# EAGLE design MotorBoardDev (EAGLE 8.6.0)
IGVC Motor Control Board
REVISION: v1.1; SCH_DESC: Motor Control Board; TEAM: IGVC

## Sheet 1 of 4: mBed Breakout
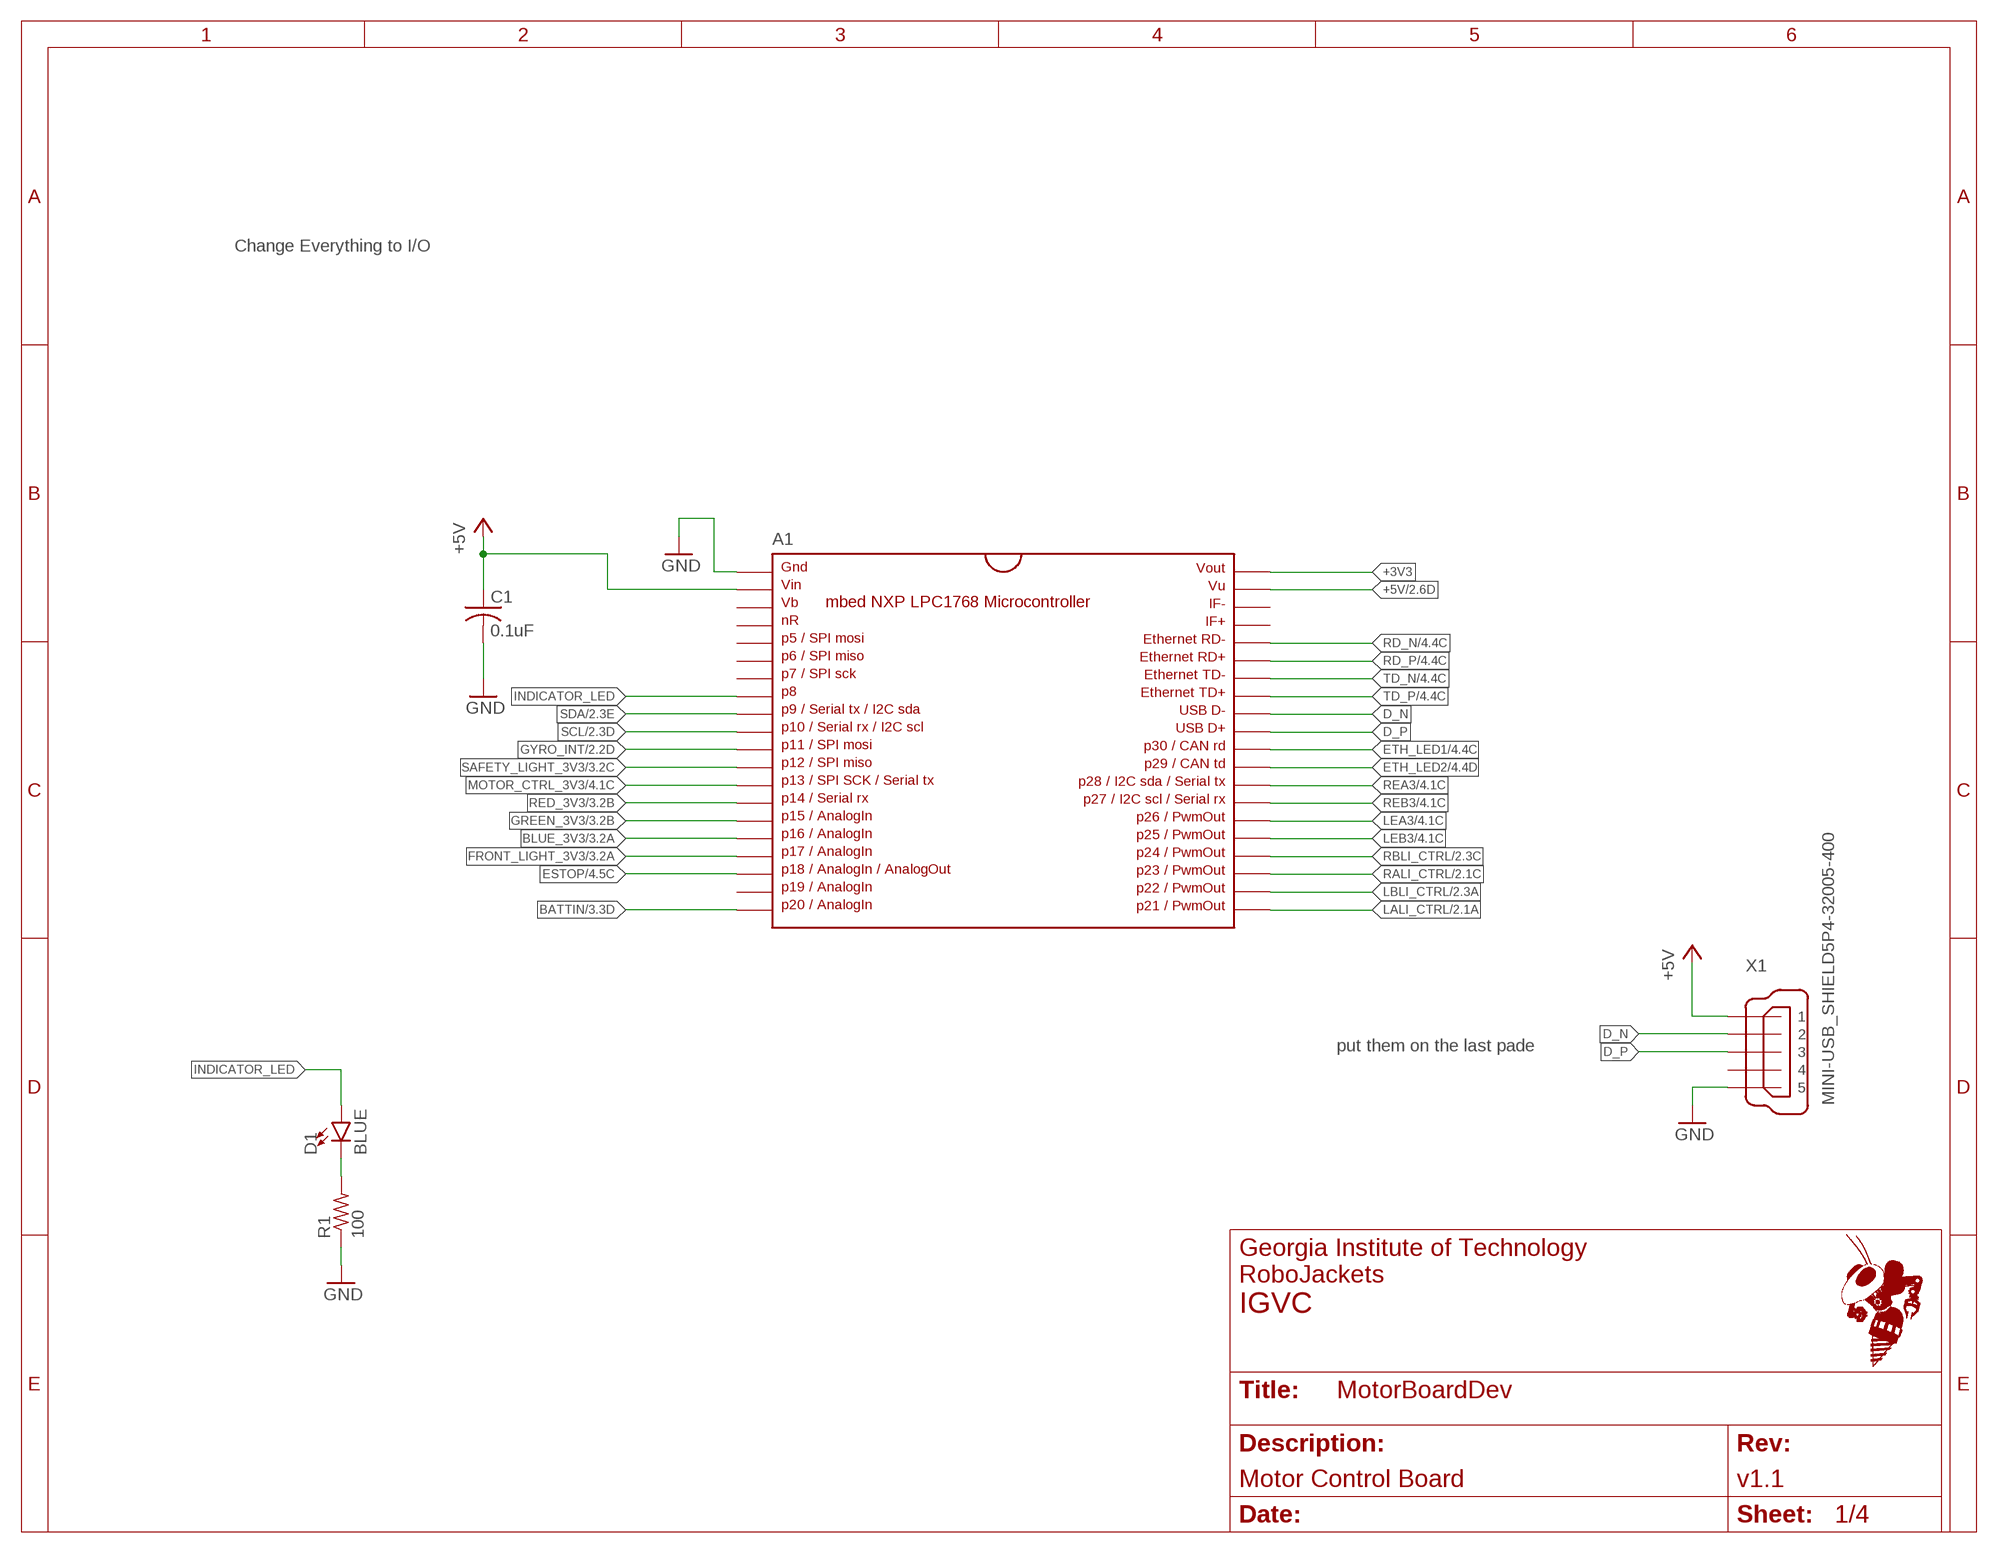
[diagram p0: schematic, sheet 1]

### Parts
A1  MBED1768  SPARKFUN-BOARDS_MBED_NXP_LPC1768  [SPARKFUN-BOARDS_DIL40_0.9]
C1  0.1uF  C-USC0603  [C0603]
D1  BLUE  LED-BLUE0603  [LED-0603]
R1  100  R-US_R0603  [R0603]
X1  MINI-USB_SHIELD5P4-32005-400  [32005-400]

### Nets
+3V3: A1.40 ; also sheet 2,3,4
+5V: A1.2 A1.39 C1.1 X1.1 ; also sheet 2,3,4
BATTIN: A1.20 ; also sheet 3
BLUE_3V3: A1.16 ; also sheet 3
D_N: A1.32 X1.2
D_P: A1.31 X1.3
ESTOP: A1.18 ; also sheet 4
ETH_LED1: A1.30 ; also sheet 4
ETH_LED2: A1.29 ; also sheet 4
FRONT_LIGHT_3V3: A1.17 ; also sheet 3
GND: A1.1 C1.2 R1.1 X1.5 ; also sheet 2,3,4
GREEN_3V3: A1.15 ; also sheet 3
GYRO_INT: A1.11 ; also sheet 2
INDI_LED_R: D1.C R1.2
INDICATOR_LED: A1.8 D1.A
LALI_CTRL: A1.21 ; also sheet 2
LBLI_CTRL: A1.22 ; also sheet 2
LEA3: A1.26 ; also sheet 4
LEB3: A1.25 ; also sheet 4
MOTOR_CTRL_3V3: A1.13 ; also sheet 4
RALI_CTRL: A1.23 ; also sheet 2
RBLI_CTRL: A1.24 ; also sheet 2
RD_N: A1.36 ; also sheet 4
RD_P: A1.35 ; also sheet 4
REA3: A1.28 ; also sheet 4
REB3: A1.27 ; also sheet 4
RED_3V3: A1.14 ; also sheet 3
SAFETY_LIGHT_3V3: A1.12 ; also sheet 3
SCL: A1.10 ; also sheet 2
SDA: A1.9 ; also sheet 2
TD_N: A1.34 ; also sheet 4
TD_P: A1.33 ; also sheet 4
Unconnected: A1.3 A1.4 A1.5 A1.6 A1.7 A1.19 A1.37 A1.38 X1.4 X1.M1(S1) X1.M2(S2) X1.M3(S3) X1.M4(S4)

### Notes on the sheet
- Change Everything to I/O
- put them on the last pade

## Sheet 2 of 4: Motor Control
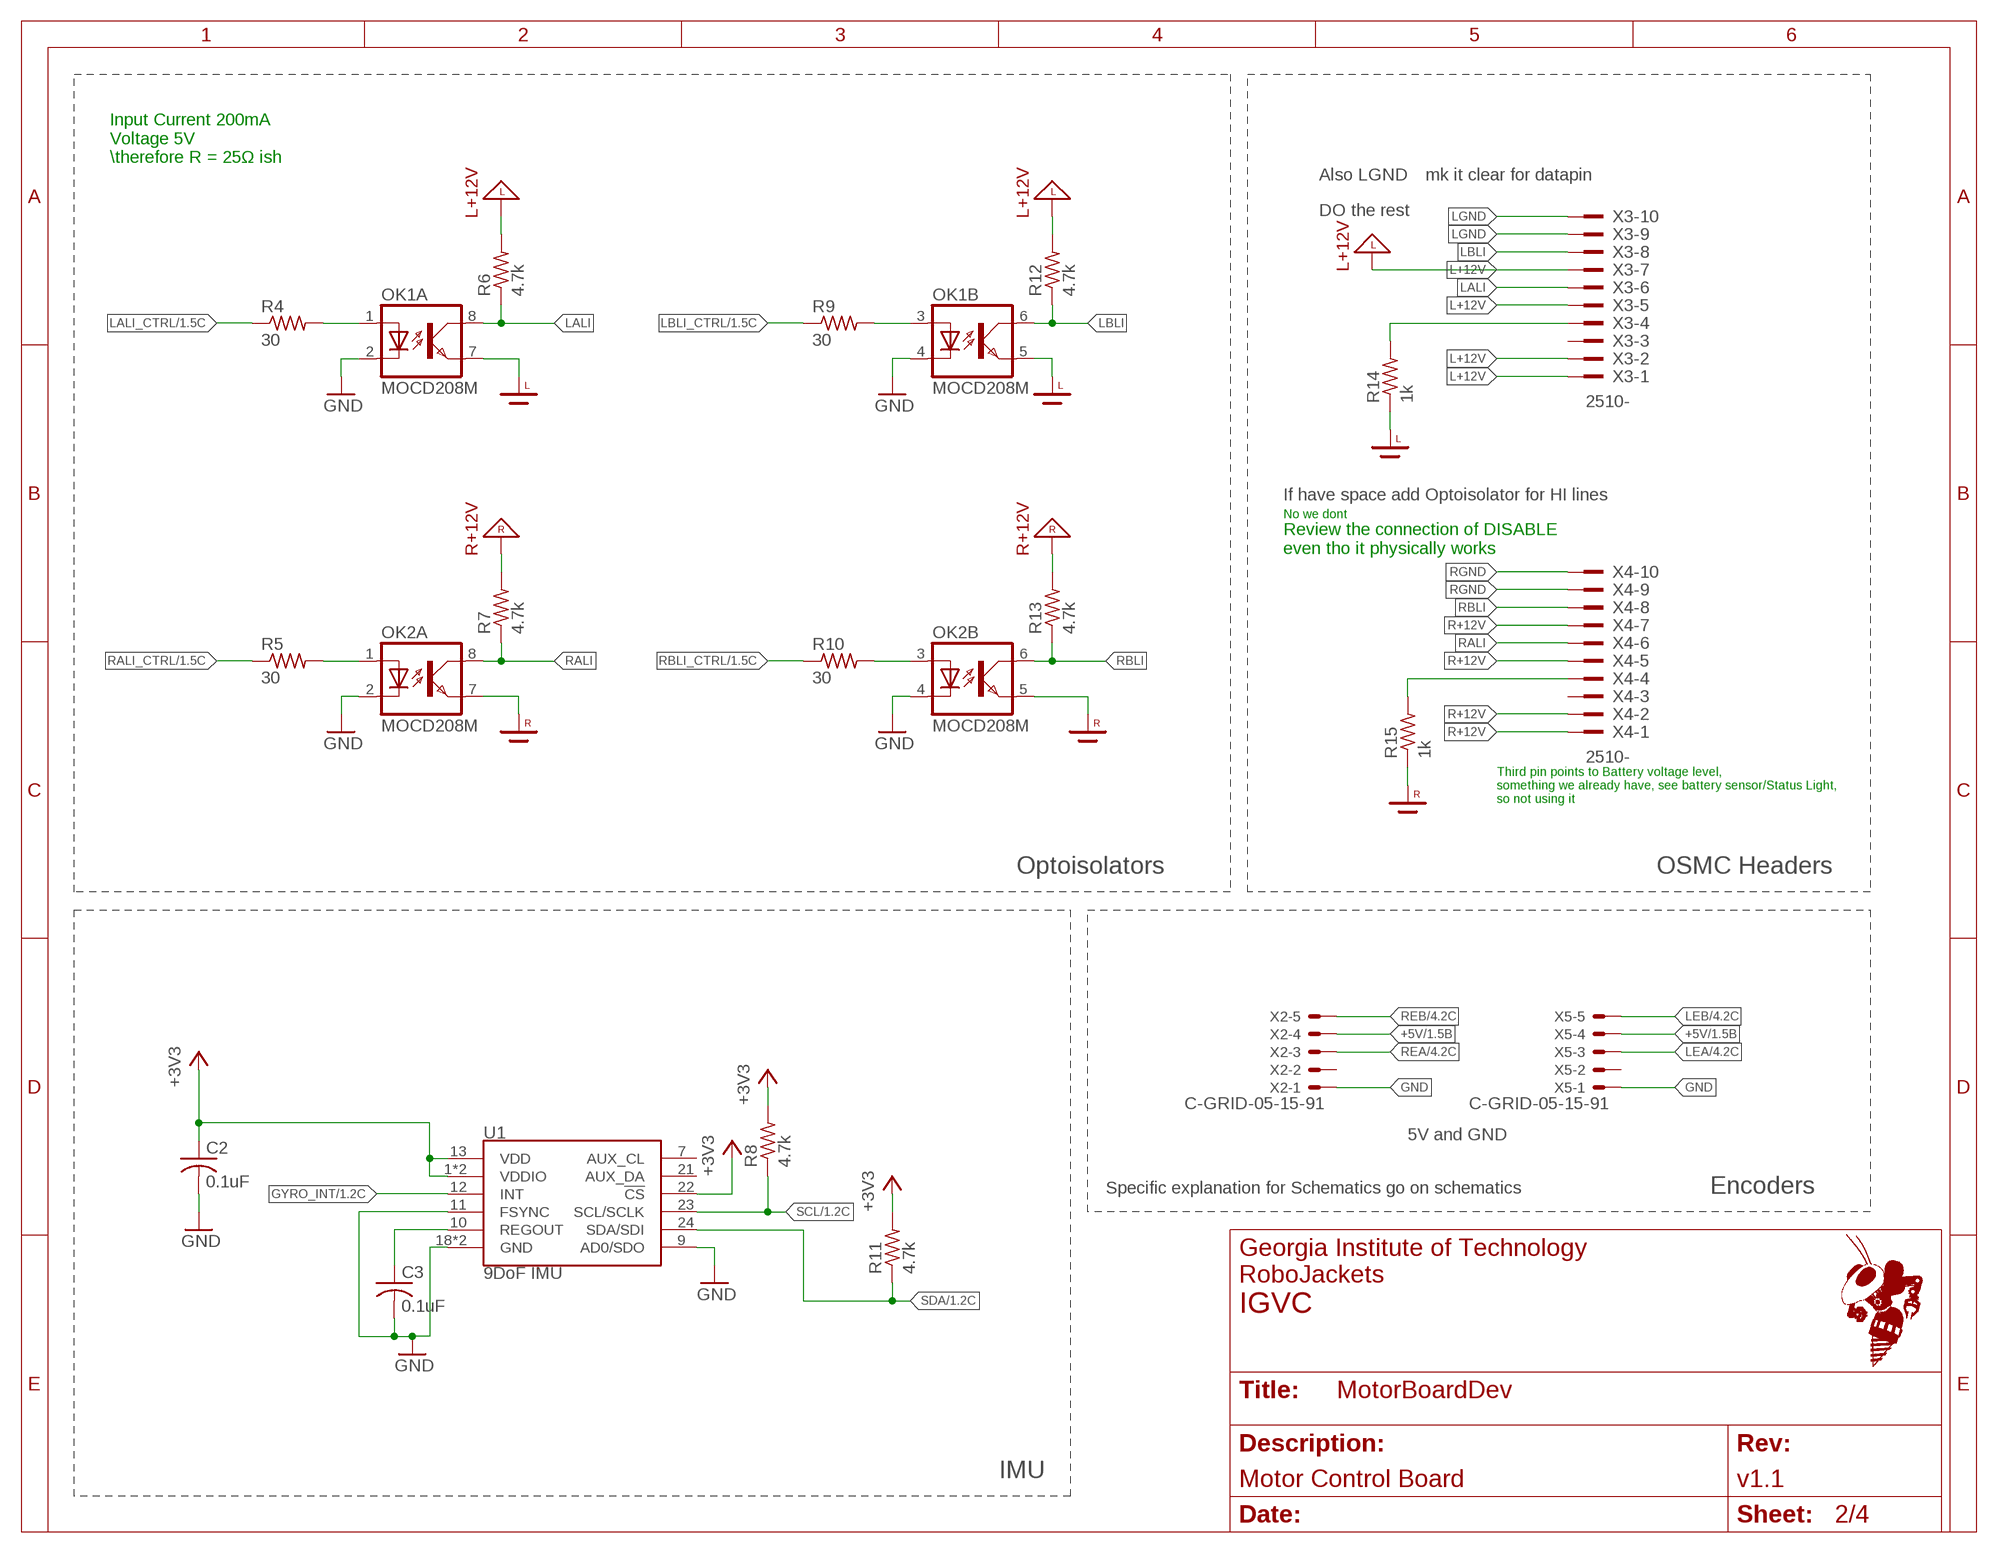
[diagram p1: schematic, sheet 2]

### Parts
C2  0.1uF  C-USC0603  [C0603]
C3  0.1uF  C-USC0603  [C0603]
OK1  MOCD208M  [SOIC08-FAIRCHILD]
OK2  MOCD208M  [SOIC08-FAIRCHILD]
R4  30  R-US_R0603  [R0603]
R5  30  R-US_R0603  [R0603]
R6  4.7k  R-US_R0603  [R0603]
R7  4.7k  R-US_R0603  [R0603]
R8  4.7k  R-US_R0603  [R0603]
R9  30  R-US_R0603  [R0603]
R10  30  R-US_R0603  [R0603]
R11  4.7k  R-US_R0603  [R0603]
R12  4.7k  R-US_R0603  [R0603]
R13  4.7k  R-US_R0603  [R0603]
R14  1k  R-US_R0603  [R0603]
R15  1k  R-US_R0603  [R0603]
U1  9DoF IMU  MPU-9250  [QFN24-3X3]
X2  C-GRID-05-15-91  [15-91-05]
X3  2510-  [PAK100/2500-10]
X4  2510-  [PAK100/2500-10]
X5  C-GRID-05-15-91  [15-91-05]

### Nets
+3V3: C2.1 R8.2 R11.2 U1.1(VDDIO) U1.8(VDDIO) U1.13(VDD) U1.22(!CS) ; also sheet 1,3,4
+5V: X2.4 X5.4 ; also sheet 1,3,4
GND: C2.2 C3.2 OK1.2(A:C) OK1.4(B:C) OK2.2(A:C) OK2.4(B:C) U1.9(AD0/SDO) U1.11(FSYNC) U1.18(GND) U1.20(GND) X2.1 X5.1 ; also sheet 1,3,4
GYRO_INT: U1.12(INT) ; also sheet 1
L+12V: R6.2 R12.2 X3.1 X3.2 X3.5 X3.7
LALI: OK1.8(A:COL) R6.1 X3.6
LALI_CTRL: R4.1 ; also sheet 1
LBLI: OK1.6(B:COL) R12.1 X3.8
LBLI_CTRL: R9.1 ; also sheet 1
LDISABLE: R14.2 X3.4
LEA: X5.3 ; also sheet 4
LEB: X5.5 ; also sheet 4
LGND: OK1.5(B:EMIT) OK1.7(A:EMIT) R14.1 X3.9 X3.10
R+12V: R7.2 R13.2 X4.1 X4.2 X4.5 X4.7
R_OK3A: OK1.1(A:A) R4.2
R_OK3B: OK1.3(B:A) R9.2
R_OK4A: OK2.1(A:A) R5.2
R_OK4B: OK2.3(B:A) R10.2
RALI: OK2.8(A:COL) R7.1 X4.6
RALI_CTRL: R5.1 ; also sheet 1
RBLI: OK2.6(B:COL) R13.1 X4.8
RBLI_CTRL: R10.1 ; also sheet 1
RDISABLE: R15.2 X4.4
REA: X2.3 ; also sheet 4
REB: X2.5 ; also sheet 4
REGOUT_C: C3.1 U1.10(REGOUT)
RGND: OK2.5(B:EMIT) OK2.7(A:EMIT) R15.1 X4.9 X4.10
SCL: R8.1 U1.23(SCL/SCLK) ; also sheet 1
SDA: R11.1 U1.24(SDA/SDI) ; also sheet 1
Unconnected: U1.7(AUX_CL) U1.21(AUX_DA) X2.2 X3.3 X4.3 X5.2

### Notes on the sheet
- Input Current 200mA
  Voltage 5V
  \therefore R = 25Ω ish
- Also LGND | mk it clear for datapin
- DO the rest
- If have space add Optoisolator for HI lines
- No we dont
- Review the connection of DISABLE
  even tho it physically works
- Third pin points to Battery voltage level,
  something we already have, see battery sensor/Status Light,
  so not using it
- Optoisolators | OSMC Headers
- 5V and GND
- Specific explanation for Schematics go on schematics | Encoders
- IMU

## Sheet 3 of 4: Light Control
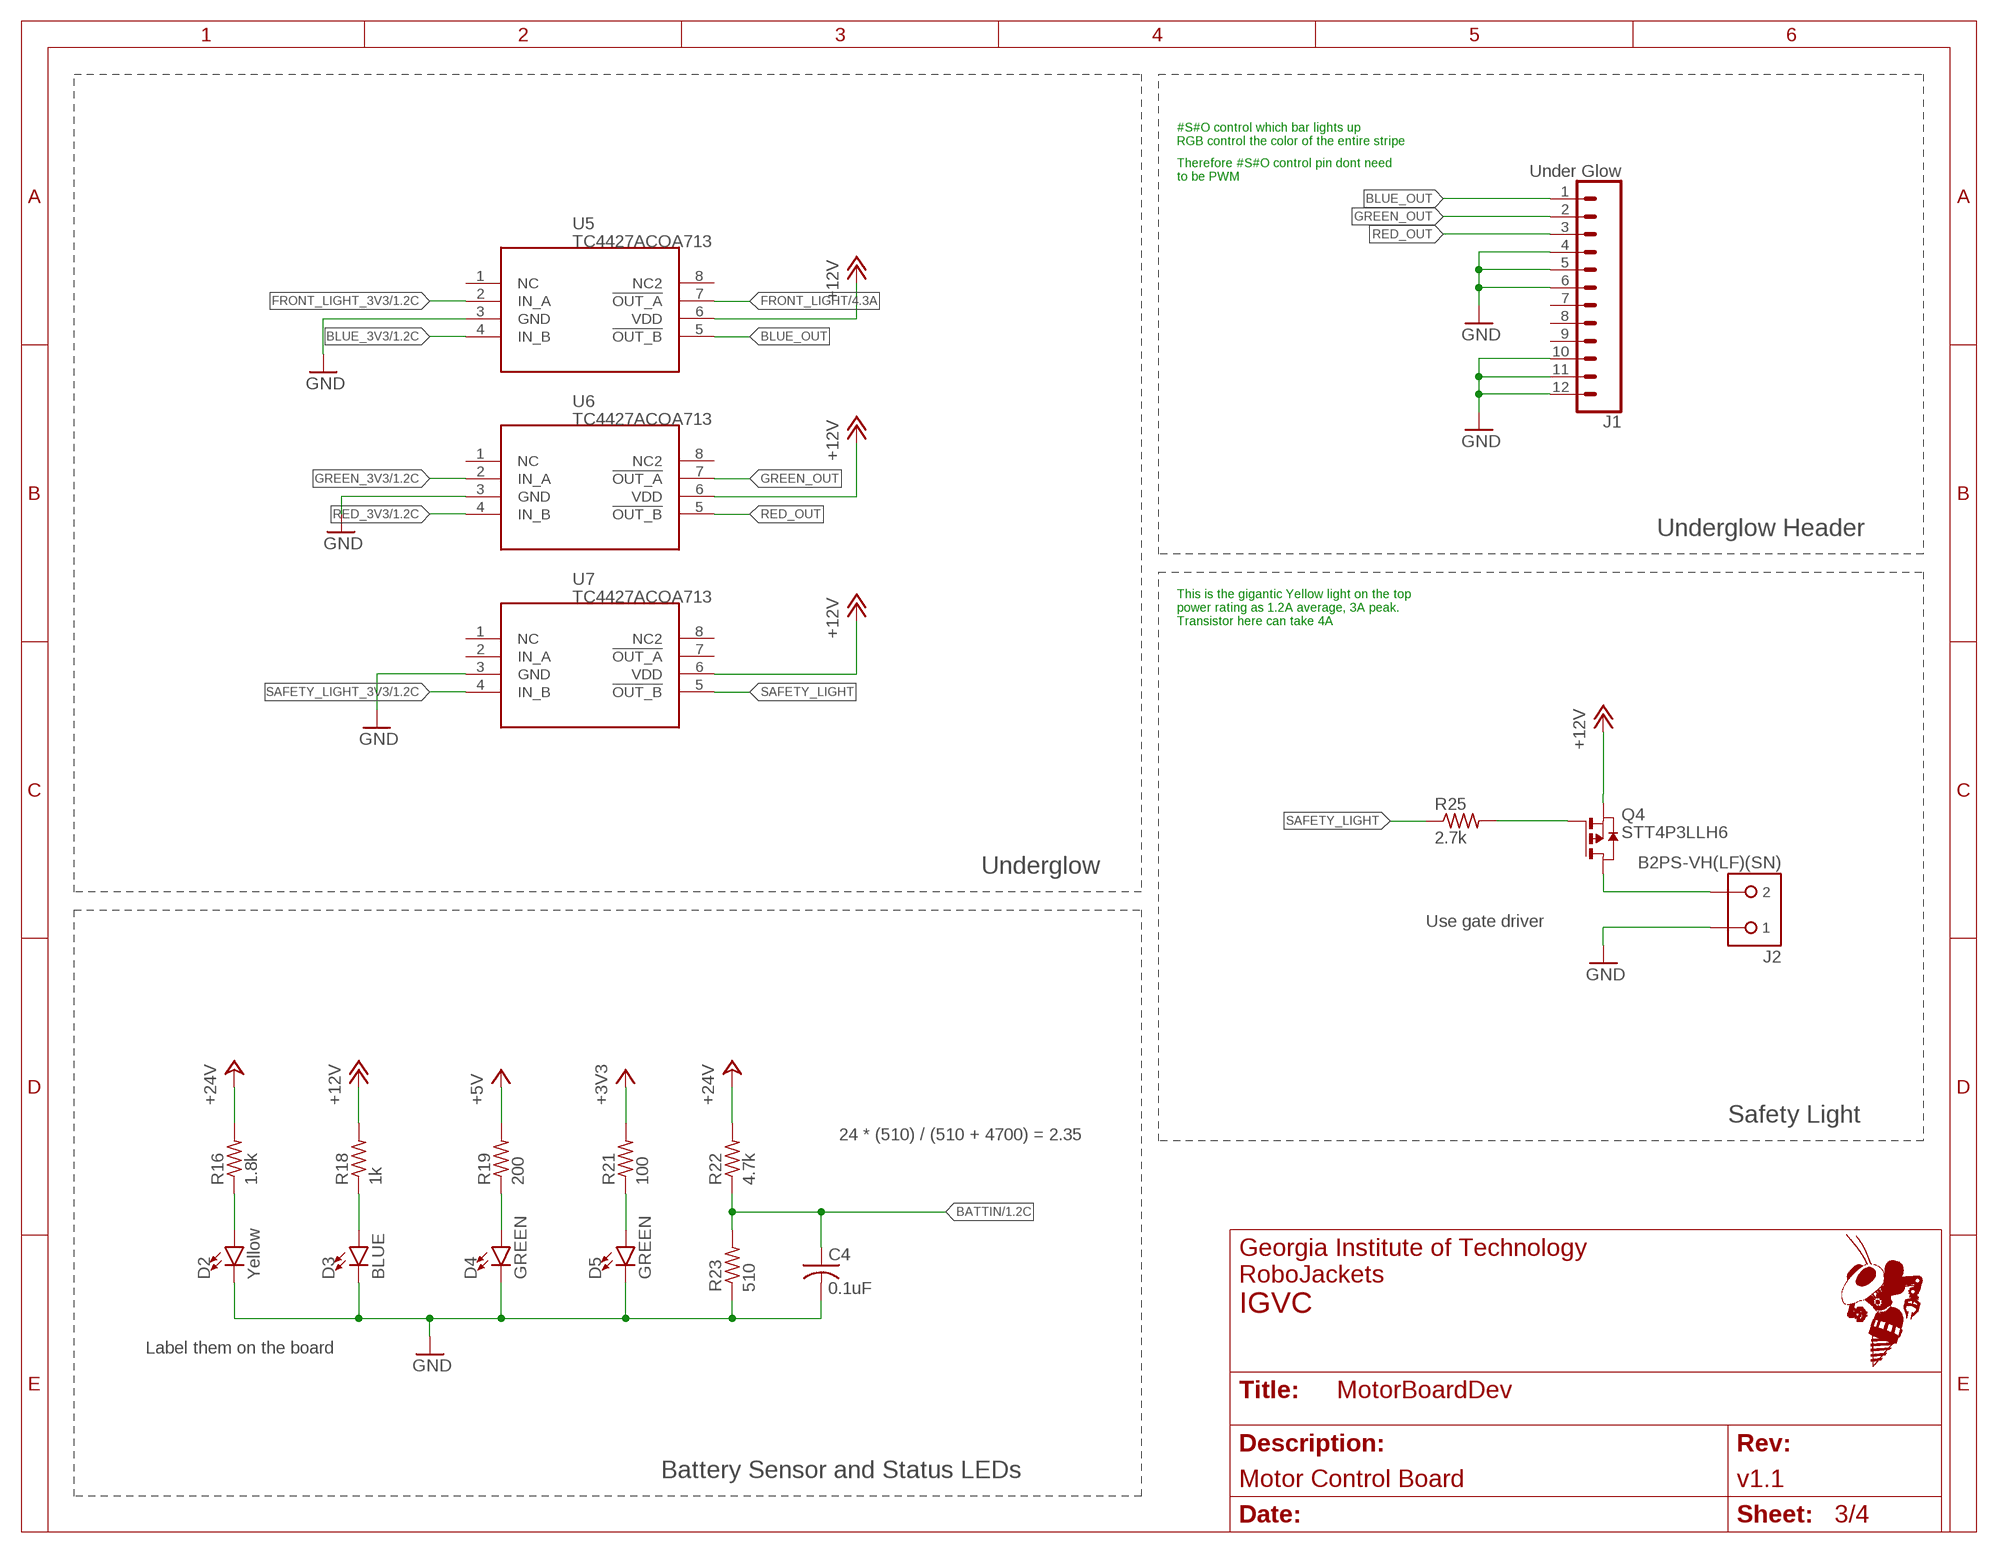
[diagram p2: schematic, sheet 3]

### Parts
C4  0.1uF  C-USC0603  [C0603]
D2  Yellow  LED-YELLOW0603  [LED-0603]
D3  BLUE  LED-BLUE0603  [LED-0603]
D4  GREEN  LED-GREEN0603  [LED-0603]
D5  GREEN  LED-GREEN0603  [LED-0603]
J1  Under Glow  CONN_12LOCK_LONGPADS  [1X12_LOCK_LONGPADS]
J2  B2PS-VH(LF)(SN)  [B2PS-CENTERED]
Q4  STT4P3LLH6  [SOT23-6]
R16  1.8k  R-US_R0603  [R0603]
R18  1k  R-US_R0603  [R0603]
R19  200  R-US_R0603  [R0603]
R21  100  R-US_R0603  [R0603]
R22  4.7k  R-US_R0603  [R0603]
R23  510  R-US_R0603  [R0603]
R25  2.7k  R-US_R0603  [R0603]
U5  TC4427ACOA713  [SOIC-8]
U6  TC4427ACOA713  [SOIC-8]
U7  TC4427ACOA713  [SOIC-8]

### Nets
3V3_LED_R: D5.A R21.1
5V_LED_R: D4.A R19.1
12V_LED_R: D3.A R18.1
24V_LED_R: D2.A R16.1
+3V3: R21.2 ; also sheet 1,2,4
+5V: R19.2 ; also sheet 1,2,4
+12V: Q4.4(S) R18.2 U5.6(VDD) U6.6(VDD) U7.6(VDD) ; also sheet 4
+24V: R16.2 R22.2 ; also sheet 4
BATTIN: C4.1 R22.1 R23.2 ; also sheet 1
BLUE_3V3: U5.4(IN_B) ; also sheet 1
BLUE_OUT: J1.1 U5.5(!OUT_B)
FRONT_LIGHT: U5.7(!OUT_A) ; also sheet 4
FRONT_LIGHT_3V3: U5.2(IN_A) ; also sheet 1
GND: C4.2 D2.C D3.C D4.C D5.C J1.4 J1.5 J1.6 J1.10 J1.11 J1.12 J2.1 R23.1 U5.3(GND) U6.3(GND) U7.3(GND) ; also sheet 1,2,4
GREEN_3V3: U6.2(IN_A) ; also sheet 1
GREEN_OUT: J1.2 U6.7(!OUT_A)
RED_3V3: U6.4(IN_B) ; also sheet 1
RED_OUT: J1.3 U6.5(!OUT_B)
SAFETY_HRD: J2.2 Q4.1(D) Q4.2(D) Q4.5(D) Q4.6(D)
SAFETY_LIGHT: R25.1 U7.5(!OUT_B)
SAFETY_LIGHT_3V3: U7.4(IN_B) ; also sheet 1
SAFETY_R: Q4.3(G) R25.2
Unconnected: J1.7 J1.8 J1.9 U5.1(NC) U5.8(NC2) U6.1(NC) U6.8(NC2) U7.1(NC) U7.2(IN_A) U7.7(!OUT_A) U7.8(NC2)

### Notes on the sheet
- #S#O control which bar lights up
  RGB control the color of the entire stripe
- Therefore #S#O control pin dont need
  to be PWM
- Underglow Header
- This is the gigantic Yellow light on the top
  power rating as 1.2A average, 3A peak.
  Transistor here can take 4A
- Underglow
- Use gate driver
- Safety Light
- 24 * (510) / (510 + 4700) = 2.35
- Label them on the board
- Battery Sensor and Status LEDs

## Sheet 4 of 4: Misc. Power and Headers
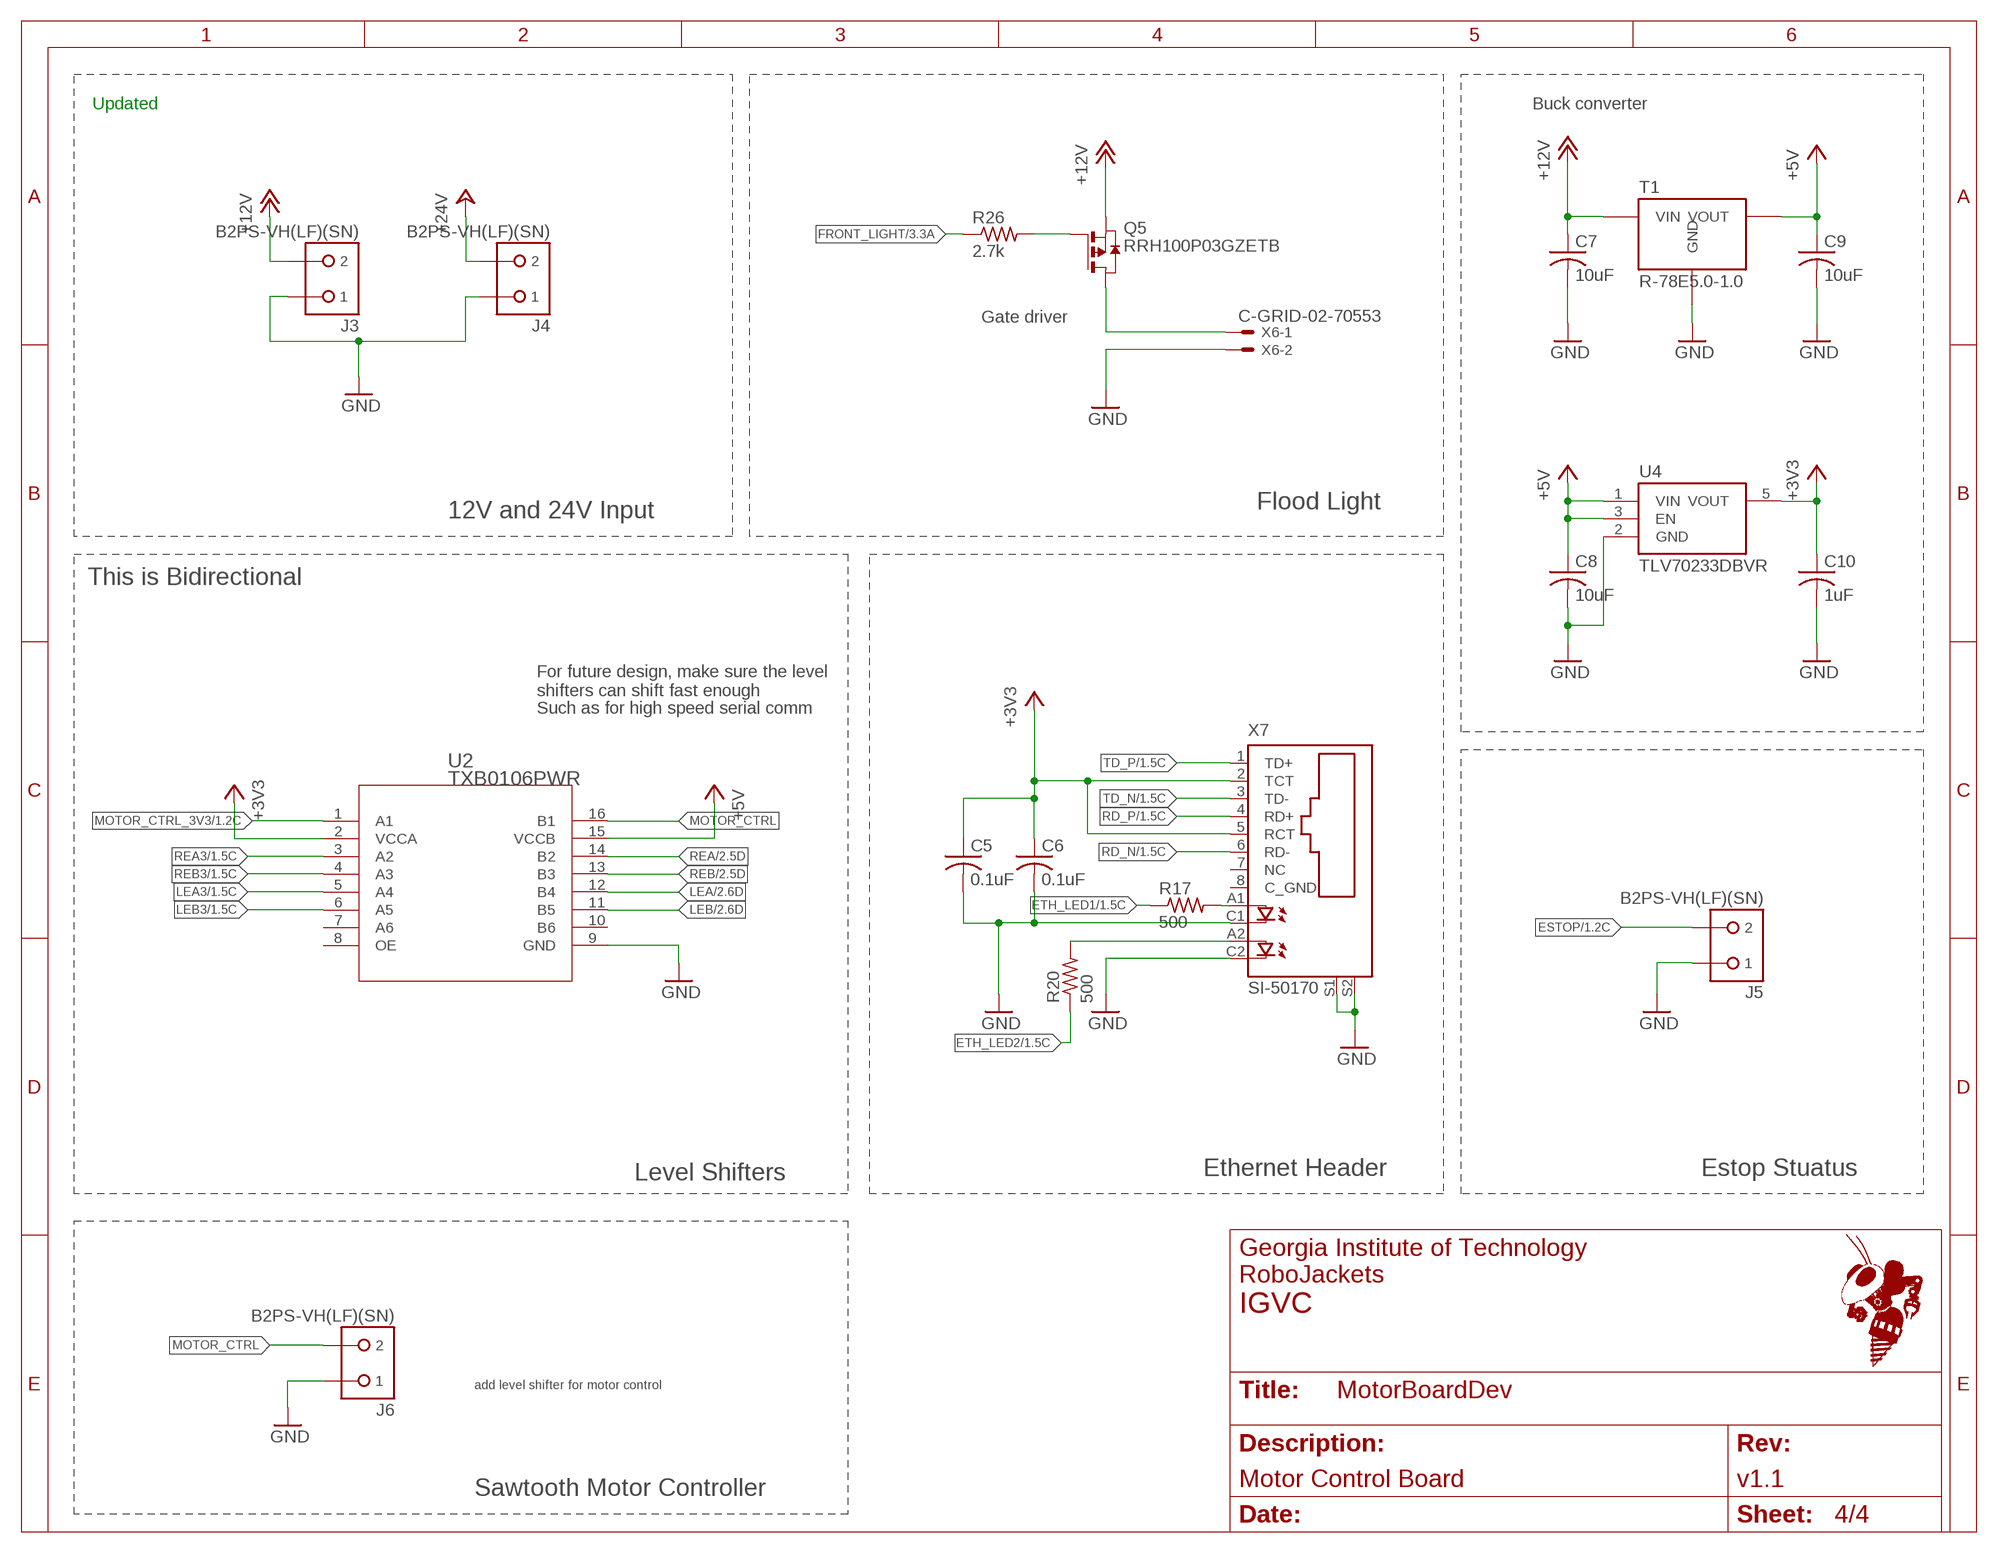
[diagram p3: schematic, sheet 4]

### Parts
C5  0.1uF  C-USC0603  [C0603]
C6  0.1uF  C-USC0603  [C0603]
C7  10uF  C-USC0805  [C0805]
C8  10uF  C-USC0805  [C0805]
C9  10uF  C-USC0805  [C0805]
C10  1uF  C-USC0805  [C0805]
J3  B2PS-VH(LF)(SN)  [B2PS-CENTERED]
J4  B2PS-VH(LF)(SN)  [B2PS-CENTERED]
J5  B2PS-VH(LF)(SN)  [B2PS-CENTERED]
J6  B2PS-VH(LF)(SN)  [B2PS-CENTERED]
Q5  RRH100P03GZETB  [SOIC-8]
R17  500  R-US_R0603  [R0603]
R20  500  R-US_R0603  [R0603]
R26  2.7k  R-US_R0603  [R0603]
T1  R-78E5.0-1.0  [R-78E]
U2  TXB0106PWR  [PW16]
U4  TLV70233DBVR  [SOT-23-5]
X6  C-GRID-02-70553  [70553-02]
X7  SI-50170  [SI-50170]

### Nets
+3V3: C5.1 C6.1 C10.1 U2.2(VCCA) U4.5(VOUT) X7.2(TCT) X7.5(RCT) ; also sheet 1,2,3
+5V: C8.1 C9.1 T1.3(VOUT) U2.15(VCCB) U4.1(VIN) U4.3(EN) ; also sheet 1,2,3
+12V: C7.1 J3.2 Q5.1(S) Q5.2(S) Q5.3(S) T1.1(VIN) ; also sheet 3
+24V: J4.2 ; also sheet 3
ESTOP: J5.2 ; also sheet 1
ETH_LED1: R17.1 ; also sheet 1
ETH_LED2: R20.1 ; also sheet 1
FRONT_HDR: Q5.5(D) Q5.6(D) Q5.7(D) Q5.8(D) X6.1
FRONT_LIGHT: R26.1 ; also sheet 3
FRONT_R: Q5.4(G) R26.2
GND: C5.2 C6.2 C7.2 C8.2 C9.2 C10.2 J3.1 J4.1 J5.1 J6.1 T1.2(GND) U2.9(GND) U4.2(GND) X6.2 X7.C1(C) X7.C2(C1) X7.S1 X7.S2 ; also sheet 1,2,3
LEA: U2.12(B4) ; also sheet 2
LEA3: U2.5(A4) ; also sheet 1
LEB: U2.11(B5) ; also sheet 2
LEB3: U2.6(A5) ; also sheet 1
MOTOR_CTRL: J6.2 U2.16(B1)
MOTOR_CTRL_3V3: U2.1(A1) ; also sheet 1
N$1: R17.2 X7.A1(A)
N$2: R20.2 X7.A2(A1)
RD_N: X7.6(RD-) ; also sheet 1
RD_P: X7.4(RD+) ; also sheet 1
REA: U2.14(B2) ; also sheet 2
REA3: U2.3(A2) ; also sheet 1
REB: U2.13(B3) ; also sheet 2
REB3: U2.4(A3) ; also sheet 1
TD_N: X7.3(TD-) ; also sheet 1
TD_P: X7.1(TD+) ; also sheet 1
Unconnected: U2.7(A6) U2.8(OE) U2.10(B6) X7.7(NC) X7.8(C_GND)

### Notes on the sheet
- Updated | Buck converter
- Gate driver
- Flood Light
- 12V and 24V Input
- This is Bidirectional
- For future design, make sure the level
  shifters can shift fast enough
- Such as for high speed serial comm
- Level Shifters | Ethernet Header | Estop Stuatus
- add level shifter for motor control
- Sawtooth Motor Controller

## Library data of the parts
A1 = MotorBoardDev:SPARKFUN-BOARDS_MBED_NXP_LPC1768: mbed LPC1768 board footprint Boards using this footprint: mbed - LPC1768 (Cortex-M3) (DEV-09564); PROD_ID: COMP-12167
C1-C10 = rcl:C-US: CAPACITOR, American symbol
D1 D3 = SparkFun-LED:LED-BLUE: Blue SMD LED Used in manufacturing of various products at SparkFun Packages: 0603 - SMD 0603 package [Product Link] <http://www.digikey.com/product-detail/en/SMLE12BC7TT86/511-1589-2-ND/1641808> 1206 - SMD1206 package [Product Link] <http://www.digikey.com/product-detail/en/lite-on-inc/LTST-C150TBKT/160-1643-1-ND/573584> SparkFun Products: ESP8266 Thing-Dev Board <https://www.sparkfun.com/products/13711> RedBoard <https://www.sparkfun.com/products/12757>; PROD_ID: DIO-08575
D2 = SparkFun-LED:LED-YELLOW: Yellow SMD LED Used in manufacturing several products at SparkFun. Packages: 0603 - SMD 0603 package[Product Link] <http://www.kingbrightusa.com/product.asp?catalog_name=LED&product_id=APT1608SYCK> 0603 -SMART - SMART SMD 0603 package (more efficient/more expensive) [Product Link] <http://www.osram-os.com/osram_os/en/products/product-catalog/led-light-emitting-diodes/smartled-0603/ly-l29k/index.jsp> LilyPad - SMD1206 package[Product Datasheet] <https://www.sparkfun.com/datasheets/DevTools/LilyPad/Q150YUS4.pdf> SparkFun Products: Blynk Board <https://www.sparkfun.com/products/13794> IOIO-OTG <https://www.sparkfun.com/products/13613> XBee Explorer Serial <https://www.sparkfun.com/products/13225>; PROD_ID: DIO-09003
D4 D5 = SparkFun-LED:LED-GREEN: Green SMD LED Used in manufacturing of various products at SparkFun Packages: 0603 - SMD 0603 package [Product Link] <http://www.futureelectronics.com/en/technologies/semiconductors/optoelectronics/leds/Pages/9894312-LTST-C190GKT.aspx?CrossPart=HSMG-C190&IM=0> LilyPad 1206 - SMD1206 LilyPad package [Product Link] <http://www.futureelectronics.com/en/Technologies/Product.aspx?ProductID=IN150NGHARVATEKCORPORATION2049943&IM=0> 1206 - SMD1206 package [Product Link] <http://www.futureelectronics.com/en/technologies/semiconductors/optoelectronics/leds/Pages/8315665-LTST-C150KGKT.aspx?IM=0> 1206 Bottom Mount -SMD 1206 Bottom Mount [Product Link] <http://www.digikey.com/product-detail/en/lite-on-inc/LTST-C230KGKT/160-1456-1-ND/386854> SparkFun Products: Pro Mini 328 -5V <https://www.sparkfun.com/products/821> RedBoard <https://www.sparkfun.com/products/12757> MP3 Trigger <https://www.sparkfun.com/products/13720> Makey Makey <https://www.sparkfun.com/products/11076>; PROD_ID: DIO-00821
J1 = SparkFun-Connectors:CONN_12: Multi connection point. Often used as Generic Header-pin footprint for 0.1 inch spaced/style header connections On any of the 0.1 inch spaced packages, you can populate with these: Break Away Headers - Straight <https://www.sparkfun.com/products/116> (PRT-00116) Break Away Male Headers - Right Angle <https://www.sparkfun.com/products/553> (PRT-00553) Female Headers <https://www.sparkfun.com/products/115> (PRT-00115) Break Away Headers - Machine Pin <https://www.sparkfun.com/products/117> (PRT-00117) Break Away Female Headers - Swiss Machine Pin <https://www.sparkfun.com/products/743> (PRT-00743) For SCREWTERMINALS and SPRING TERMINALS visit here: Screw Terimnals on SparkFun.com <https://www.sparkfun.com/search/results?term=Screw+Terminals> (5mm/3.5mm/2.54mm spacing) This device is also useful as a general connection point to wire up your design to another part of your project. Our various solder wires solder well into these plated through hole pads. Hook-Up Wire - Assortment (Stranded, 22 AWG) <https://www.sparkfun.com/products/11375> (PRT-11375) Hook-Up Wire - Assortment (Solid Core, 22 AWG) <https://www.sparkfun.com/products/11367> (PRT-11367) View the entire wire category on our website here <https://www.sparkfun.com/categories/141> Special notes: Molex polarized connector foot print use with SKU : PRT-08231 with associated crimp pins and housings. 1MM SMD Version SKU: PRT-10208 NOTES ON THE VARIANTS LOCK and LOCK_LONGPADS... This footprint was designed to help hold the alignment of a through-hole component (i.e. 6-pin header) while soldering it into place. You may notice that each hole has been shifted either up or down by 0.005 of an inch from it's more standard position (which is a perfectly straight line). This slight alteration caused the pins (the squares in the middle) to touch the edges of the holes. Because they are alternating, it causes a "brace" to hold the component in place. 0.005 has proven to be the perfect amount of "off-center" position when using our standard breakaway headers. Although looks a little odd when you look at the bare footprint, once you have a header in there, the alteration is very hard to notice. Also,if you push a header all the way into place, it is covered up entirely on the bottom side.
J2-J6 = RoboJackets-Connectors:B2P?-VH(LF)(SN): Power Connector Brand: JST Sales America Inc. <https://www.jst.com/> Series: VH <http://www.digikey.com/product-search/en?FV=fff40016,fff802f3,ffec0e9d> Distributor: Digi-Key <http://www.digikey.com/product-detail/en/B2PS-VH%28LF%29%28SN%29/455-1648-ND/926555>; DIGIKEY: 455-1648-ND; MPN: B2PS-VH(LF)(SN)
OK1 OK2 = optocoupler:MOCD20*M: MOCD207M, MOCD208M Dual Channel Phototransistor Small Outline Surface Mount Optocouplers Source: Data sheet <http://www.fairchildsemi.com/ds/MO%2FMOCD207-M.pdf>; MF: FAIRCHILD SEMICONDUCTOR; MPN: MOCD208M; OC_FARNELL: 1505465; OC_NEWARK: 34C7498
Q4 = MotorBoardDev:STT4P3LLH6
Q5 = MotorBoardDev:RRH100P03GZETB
R1 R4-R23 R25 R26 = rcl:R-US_: RESISTOR, American symbol
T1 = MotorBoardDev:R-78E5.0-1.0
U1 = SparkFun-Sensors:MPU-9250: MPU-9250 9 Degree of Freedom IMU System in Package that contains MPU-6500 & AK8963 NC pin 19. 2-6 & 14-17 not internally connected. May be used for PCB trace routing. Datasheet <https://cdn.sparkfun.com/assets/learn_tutorials/5/5/0/MPU9250REV1.0.pdf> SparkFun Products: SparkFun 9DoF Razor IMU M0 <https://www.sparkfun.com/products/14001> SparkFun IMU Breakout - MPU-9250 <https://www.sparkfun.com/products/13762>; PROD_ID: IC-13192
U2 = MotorBoardDev:TXB0106PWR; MANUFACTURER_PART_NUMBER: TXB0106PWR; VENDOR: Texas Instruments
U4 = RoboJackets-PowerICs:TLV70233; DIGIKEY: 296-32415-1-ND; MPN: TLV70233DBVR
U5-U7 = MotorBoardDev:TC4427ACOA713
X1 = con-cypressindustries:MINI-USB_SHIELD5P4-: MINI USB-B R/A W/O POST 5 pol. Source: www.cypressindustries.com; OC_FARNELL: unknown; OC_NEWARK: unknown
X2 X5 = con-molex:C-GRID-05: CONNECTOR wire to board 2.54 mm (0.100") pitch header; OC_FARNELL: unknown; OC_NEWARK: unknown
X3 X4 = con-3m:2510-: 3M (TM) Pak 100 4-Wall Header Source: 3M; MF: 3M; MPN: 2510-6002UB; OC_FARNELL: 9838244; OC_NEWARK: 46F4725
X6 = con-molex:C-GRID-02: CONNECTOR wire to board 2.54 mm (0.100") pitch header; OC_FARNELL: unknown; OC_NEWARK: unknown
X7 = con-stewart:SI-50170: Ethernet Connector MagJack (R) Source: www.stewartconnector.com .. si-50170.pdf; OC_FARNELL: unknown; OC_NEWARK: unknown

## Board
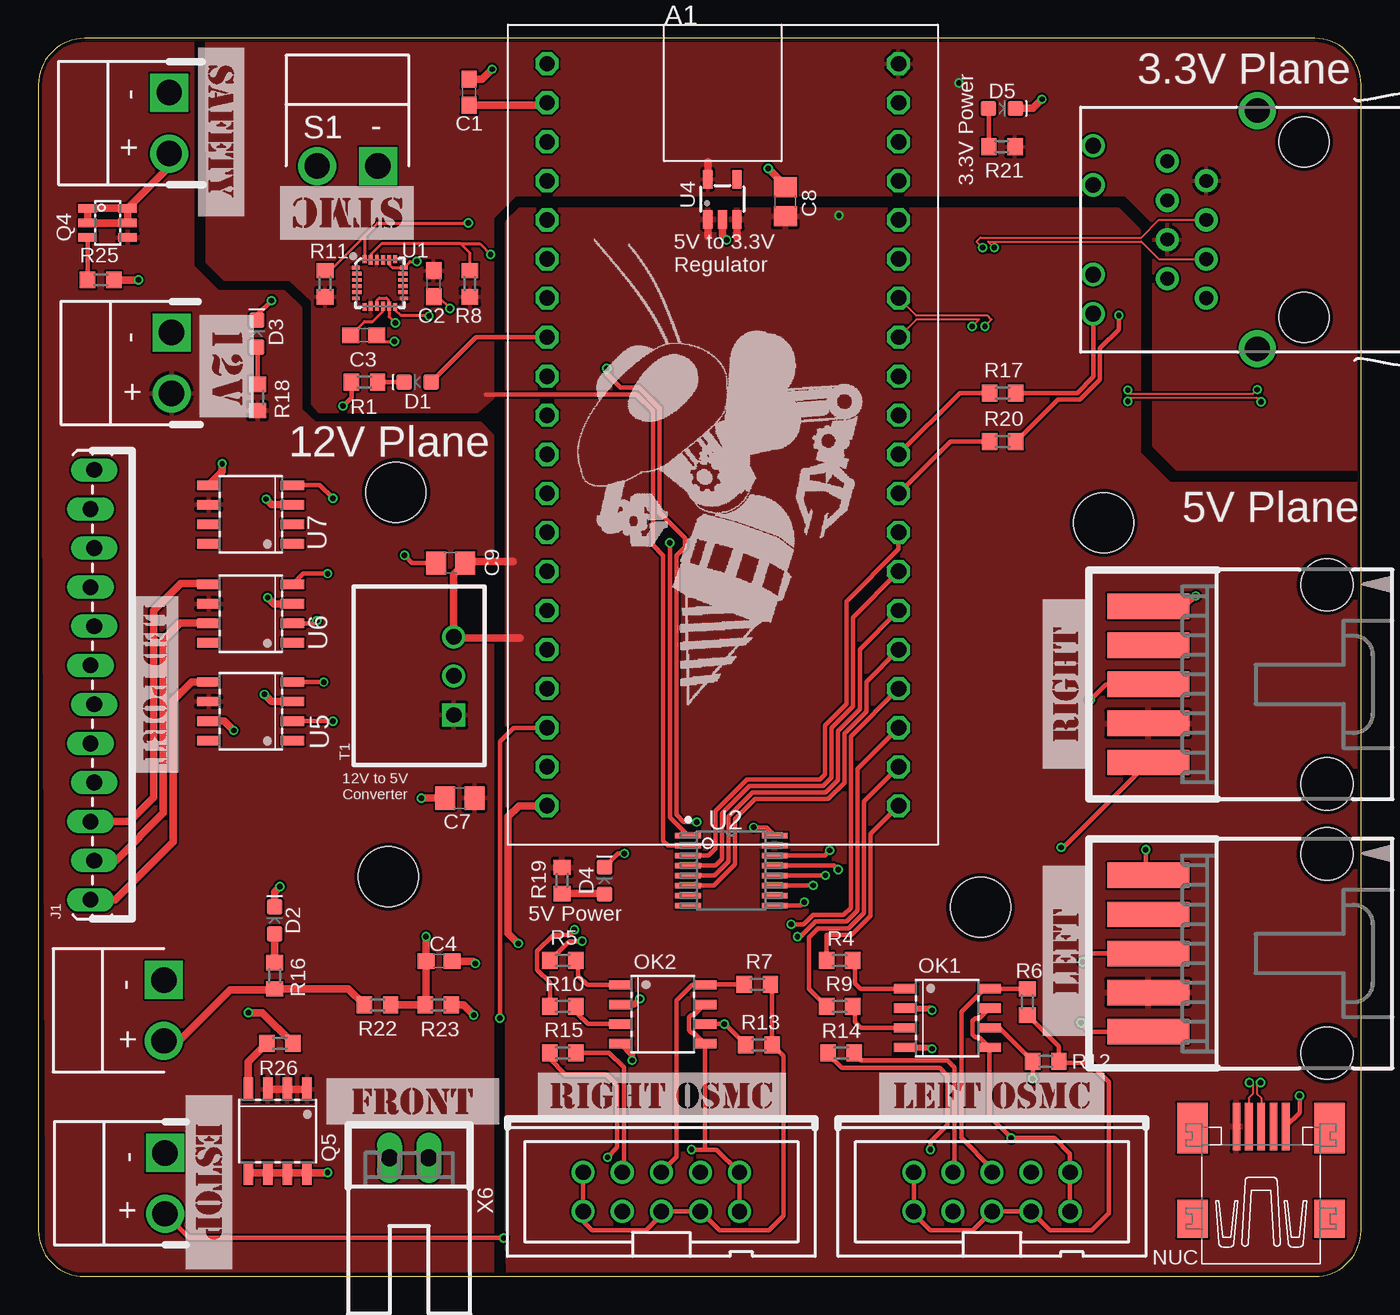
[diagram p4: board, top side]
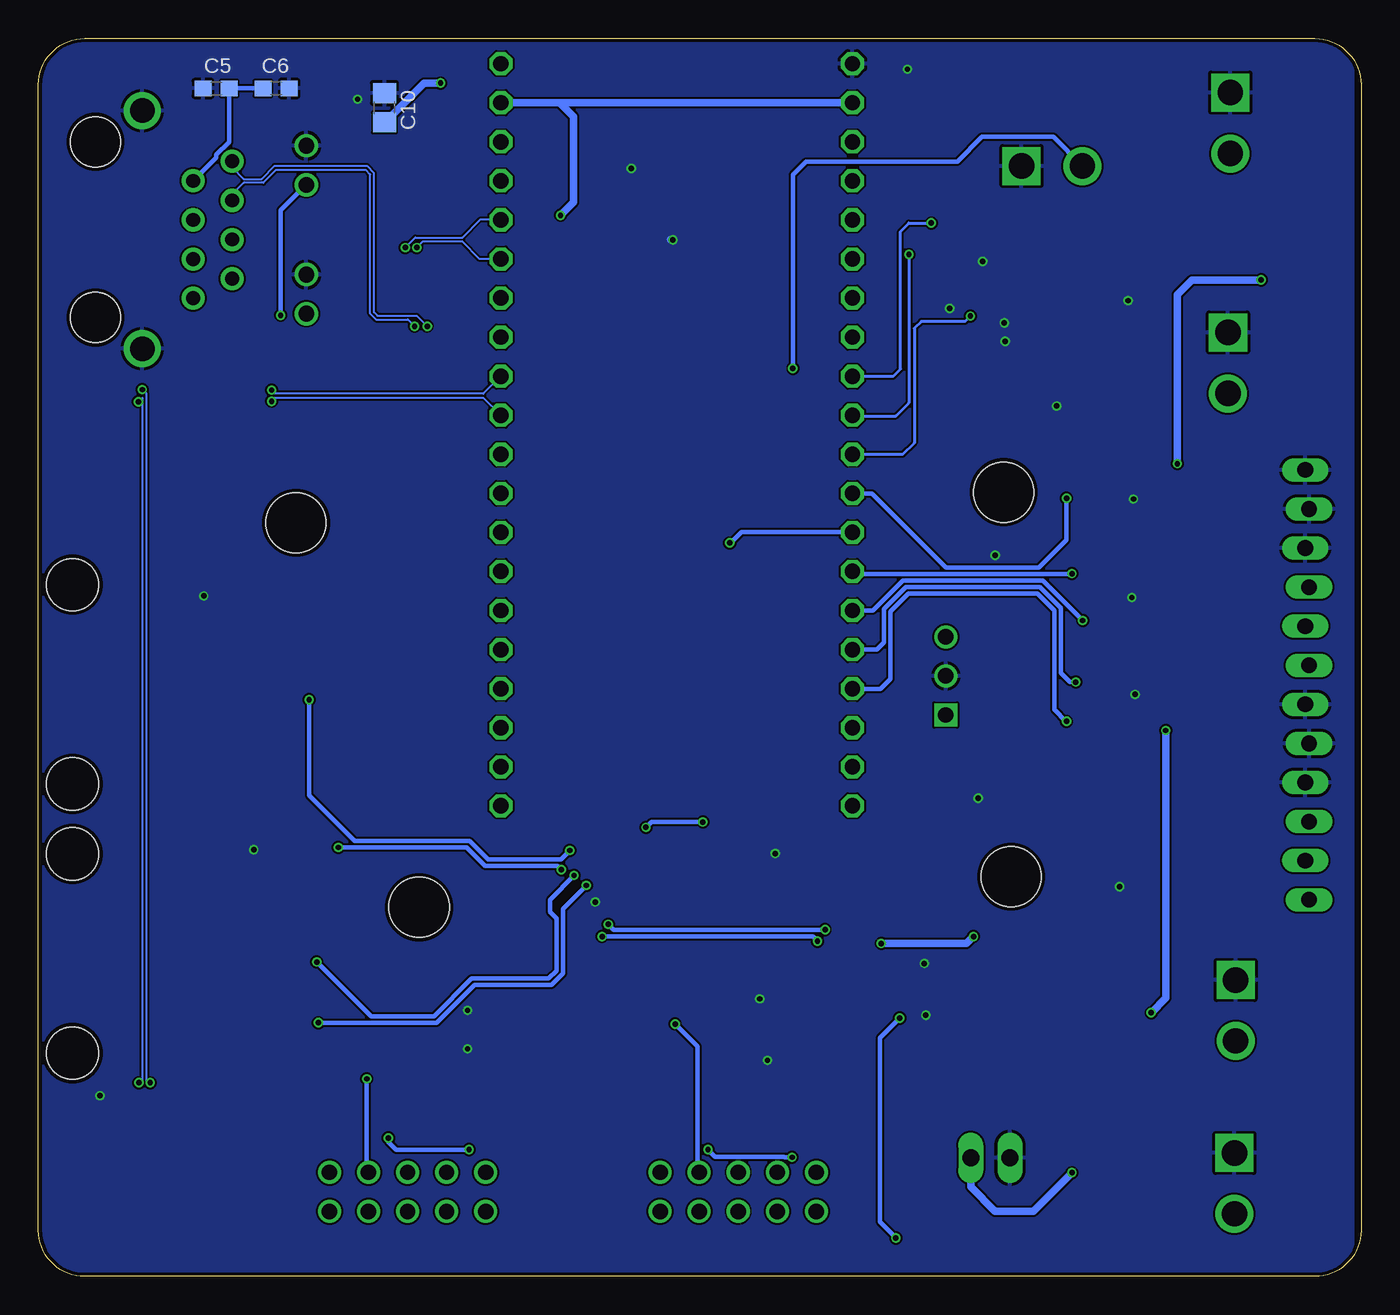
[diagram p5: board, bottom side, seen from below]

Size 86 x 80.5 mm. Coordinates in mm from the lower left corner, seen from the top.
Outline: 83,80.5 3,80.5 arc90 0,77.5 0,3 arc90 3,0 83,0 arc90 86,3 86,77.5 arc90 83,80.5
Copper layers (1*16): Top 0.018mm / dielectric 1.55mm / Bottom 0.018mm
Design rules "eC_2Layer_PClass7_BaseCopperO18": minimum track width 0.125mm, minimum drill 0.35mm, track to track 0.125mm, track to pad 0.125mm, pad to pad 0.125mm, via to via 0.125mm, smd to smd 0mil, copper to edge 0.25mm, drill to drill 0.35mm, minimum pad ring 0.175mm, minimum via ring 0.125mm, stop-mask expansion 0mil, vias tented up to drill 0.45mm, thermal gap 0.2mm

### Footprints (pad centres in the part's own frame; a part is rotated, then mirrored left to right if it is on the bottom)
SPARKFUN-BOARDS_DIL40_0.9 = drill 1 pad 1.397 octagon: 1 -22.86,-11.43; 2 -20.32,-11.43; 3 -17.78,-11.43; 4 -15.24,-11.43; 5 -12.7,-11.43; 6 -10.16,-11.43; 7 -7.62,-11.43; 8 -5.08,-11.43; 9 -2.54,-11.43; 10 0,-11.43; 11 2.54,-11.43; 12 5.08,-11.43; 13 7.62,-11.43; 14 10.16,-11.43; 15 12.7,-11.43; 16 15.24,-11.43; 17 17.78,-11.43; 18 20.32,-11.43; 19 22.86,-11.43; 20 25.4,-11.43; 21 25.4,11.43; 22 22.86,11.43; 23 20.32,11.43; 24 17.78,11.43; 25 15.24,11.43; 26 12.7,11.43; 27 10.16,11.43; 28 7.62,11.43; 29 5.08,11.43; 30 2.54,11.43; 31 0,11.43; 32 -2.54,11.43; 33 -5.08,11.43; 34 -7.62,11.43; 35 -10.16,11.43; 36 -12.7,11.43; 37 -15.24,11.43; 38 -17.78,11.43; 39 -20.32,11.43; 40 -22.86,11.43
C0603 = smd 1.1 x 1: 1 -0.85,0; 2 0.85,0
C0805 = smd 1.3 x 1.5: 1 -0.95,0; 2 0.95,0
LED-0603 = smd 1 x 1: A -0.877,0; C 0.877,0
1X12_LOCK_LONGPADS = drill 1.016 long: 1 0,0.127; 2 2.54,-0.127; 3 5.08,0.127; 4 7.62,-0.127; 5 10.16,0.127; 6 12.7,-0.127; 7 15.24,0.127; 8 17.78,-0.127; 9 20.32,0.127; 10 22.86,-0.127; 11 25.4,0.127; 12 27.94,-0.127
B2PS-CENTERED = drill 1.65 square: 1 -1.98,0 | drill 1.65: 2 1.98,0
SOIC08-FAIRCHILD = smd 0.61 x 1.52: 1 -1.905,-2.723; 2 -0.635,-2.723; 3 0.635,-2.723; 4 1.905,-2.723; 5 1.905,2.723; 6 0.635,2.723; 7 -0.635,2.723; 8 -1.905,2.723
SOT23-6 = smd 0.55 x 1.2: 1 -0.95,-1.3; 2 0,-1.3; 3 0.95,-1.3; 4 0.95,1.3; 5 0,1.3; 6 -0.95,1.3
SOIC-8 = smd 0.61 x 1.52: 1 -1.905,-2.723; 2 -0.635,-2.723; 3 0.635,-2.723; 4 1.905,-2.723; 5 1.905,2.723; 6 0.635,2.723; 7 -0.635,2.723; 8 -1.905,2.723
R0603 = smd 1 x 1.1: 1 -0.85,0; 2 0.85,0
R-78E = drill 1 square: 1 -2.54,0 | drill 1: 2 0,0; 3 2.54,0
QFN24-3X3 = smd 0.495 x 0.25: 1 -1.552,1; 6 -1.552,-1; 13 1.552,-1; 18 1.552,1 | smd 0.6 x 0.25: 2 -1.5,0.6; 3 -1.5,0.2; 4 -1.5,-0.2; 5 -1.5,-0.6; 14 1.5,-0.6; 15 1.5,-0.2; 16 1.5,0.2; 17 1.5,0.6 | smd 0.25 x 0.495: 7 -1,-1.552; 12 1,-1.552; 19 1,1.552; 24 -1,1.552 | smd 0.25 x 0.6: 8 -0.6,-1.5; 9 -0.2,-1.5; 10 0.2,-1.5; 11 0.6,-1.5; 20 0.6,1.5; 21 0.2,1.5; 22 -0.2,1.5; 23 -0.6,1.5
PW16 = smd 1.676 x 0.356: 1 -2.819,2.275; 2 -2.819,1.625; 3 -2.819,0.975; 4 -2.819,0.325; 5 -2.819,-0.325; 6 -2.819,-0.975; 7 -2.819,-1.625; 8 -2.819,-2.275; 9 2.819,-2.275; 10 2.819,-1.625; 11 2.819,-0.975; 12 2.819,-0.325; 13 2.819,0.325; 14 2.819,0.975; 15 2.819,1.625; 16 2.819,2.275
SOT-23-5 = smd 0.6 x 1.2: 1 -0.95,-1.306; 2 0,-1.306; 3 0.95,-1.306; 4 0.95,1.306; 5 -0.95,1.306
STANDOFF-HOLE = hole 3.9: 0,0
32005-400 = smd 3.1 x 0.5: 1 3,1.6; 2 3,0.8; 3 3,0; 4 3,-0.8; 5 3,-1.6 | smd 2.5 x 2: M1 -3,-4.45; M2 -3,4.45 | smd 3.3 x 2: M3 2.9,4.45; M4 2.9,-4.45
15-91-05 = smd 1.651 x 5.334: 1 -5.08,-10.795; 2 -2.54,-10.795; 3 0,-10.795; 4 2.54,-10.795; 5 5.08,-10.795 | hole 3.404: -6.477,0.838; 6.477,0.838
PAK100/2500-10 = drill 1 pad 1.422: 1 -5.08,-1.27; 2 -5.08,1.27; 3 -2.54,-1.27; 4 -2.54,1.27; 5 0,-1.27; 6 0,1.27; 7 2.54,-1.27; 8 2.54,1.27; 9 5.08,-1.27; 10 5.08,1.27
70553-02 = drill 1.092 long: 1 -1.27,-7.62; 2 1.27,-7.62
SI-50170 = drill 0.9 pad 1.5: 1 4.445,5.842; 2 3.175,3.302; 3 1.905,5.842; 4 0.635,3.302; 5 -0.635,5.842; 6 -1.905,3.302; 7 -3.175,5.842; 8 -4.445,3.302 | drill 1.016 pad 1.5: A1 -5.461,10.668; A2 2.921,10.668; C1 -2.921,10.668; C2 5.461,10.668 | drill 1.6 pad 2.2: S1 -7.747,0; S2 7.747,0 | hole 3.251: -5.715,-3.048; 5.715,-3.048

### Placement (x,y rotation side)
A1  44.5,56 270 top
C1  28,77 90 top
C2  25.7,64.55 270 top
C3  21.15,61.2 0 top
C4  26.05,20.5 0 top
C5  74.45,77.25 180 bottom
C6  70.55,77.25 0 bottom
C7  27.4,31.1 180 top
C8  48.56,69.88 90 top
C9  26.8,46.4 180 top
C10  63.5,76 90 bottom
D1  24.65,58.15 180 top
D2  15.35,23.15 90 top
D3  14.2,61.3 90 top
D4  36.8,25.73 90 top
D5  62.65,75.95 0 top
J1  3.5,24.5 90 top
J2  8.5,75 270 top
J3  8.65,59.4 270 top
J4  8.15,17.3 270 top
J5  8.23,6.05 270 top
J6  20.1,72.2 180 top
OK1  59.1,16.8 270 top
OK2  40.6,17.05 270 top
Q4  4.5,68.5 270 top
Q5  15.55,9.45 180 top
R1  21.2,58.15 0 top
R4  52.1,20.55 0 top
R5  34.1,20.55 0 top
R6  64.3,17.85 270 top
R7  46.75,19 0 top
R8  28.05,64.55 270 top
R9  52.1,17.55 0 top
R10  34.1,17.55 0 top
R11  18.65,64.55 270 top
R12  65.5,14 0 top
R13  46.85,15.05 0 top
R14  52.2,14.55 0 top
R15  34.1,14.55 0 top
R16  15.35,19.55 270 top
R17  62.7,57.45 0 top
R18  14.25,57.15 270 top
R19  34.05,25.75 90 top
R20  62.7,54.3 0 top
R21  62.65,73.45 0 top
R22  22.05,17.65 180 top
R23  26,17.65 180 top
R25  4.05,64.8 180 top
R26  15.7,15.15 180 top
T1  27,39.05 90 top
U1  22.2,64.6 0 top
U2  45.05,26.4 0 top
U4  44.47,70.04 0 top
U5  13.8,36.75 90 top
U6  13.8,43.1 90 top
U7  13.8,49.55 90 top
U$1  [STANDOFF-HOLE]  23.25,51 0 top
U$2  [STANDOFF-HOLE]  22.75,26 0 top
U$3  [STANDOFF-HOLE]  61.25,24 0 top
U$4  [STANDOFF-HOLE]  69.25,49 0 top
U$5  [12V]  10.5,62.5 270 top
U$6  [24V]  9.8,20.2 270 top
U$7  [LEFTOSMC]  54.7,10.25 0 top
U$8  [RIGHTOSMC]  32.5,10.25 0 top
U$9  [LEDPORT]  6.1,44.2 270 top
U$10  [ROBOBUZZ_1.4X]  42.15,37.15 0 top
U$11  [ESTOP]  9.6,11.75 270 top
U$12  [SAFETY]  10.4,79.9 270 top
U$13  [LEFT]  68.3,15.65 90 top
U$14  [RIGHT]  68.3,33.05 90 top
U$15  [FRONT]  18.75,9.9 0 top
U$16  [STMC]  24.4,70.9 180 top
X1  79.5,6.75 90 top
X2  82.95,38.5 270 top
X3  62,5.5 0 top
X4  40.5,5.5 0 top
X5  82.95,21 270 top
X6  24.1,0.1 180 top
X7  79.25,68.06 90 top

### Tracks (layer width: path | path; a pad name or v marks a point on that pad's centre or on a via)
3V3_LED_R
  Top 0.3: R21.1 61.8,75.92
  Top 0.5: 61.8,75.92 D5.A
5V_LED_R
  Top 0.5: R19.1 36.75,24.9 D4.A
12V_LED_R
  Top 0.3: D3.A 14.25,60.42 R18.1
24V_LED_R
  Top 0.5: 15.37,22.35 D2.A R16.1
+3V3  (via drill 0.35)
  Top 0.3: U2.2 40.92,28.02 40.62,28.32 40.62,46.88 39.95,47.55 39.95,56.3 38.9,57.35 29.1,57.35
  Top 0.5: U4.5 43.52,72.49
  Bottom 0.3: X7.2 74.43,72.75 74.43,72.94 73.6,73.77 C5.1 C6.1
  Bottom 0.5: v59.85,77.6 60.92,77.6 63.47,75.05 C10.1
  pour Top: 70.65,70.35 72.5,68.5 72.5,54 74,52.5 85.75,52.5 85.75,77.25 arc90 82.75,80.25 10.9,80.25 10.95,65.95 12.05,64.85 16.3,64.85 17.8,63.45 17.8,56.75 18.25,56.25 28.55,56.25 29.55,57.1 29.55,68.85 31.05,70.35
+5V  (via drill 0.35)
  Top 0.5: 43.52,67.61 U4.1 | U4.3 45.42,67.58 45.44,67.56 | 30.85,46.5 27.85,46.5 C9.1 27,45.65 T1.3 27.09,41.5 31.3,41.5 | C1.1 32.9,76.15 A1.2
  Bottom 0.5: 52.12,76.32 51.2,75.4 51.2,69.85 v52.05,69 | 52.12,76.32 A1.39 | 52.12,76.32 A1.2
  pour Top: 30.7,-2.05 30.55,2.1 30.55,68.55 31.35,69.35 70.15,69.35 71.5,68 71.5,53.5 73.5,51.5 95,51.5 95,-2
+12V
  Top 0.5: Q5.1 Q5.2 Q5.3
  pour Top: 10,80.5 10,65.65 11.65,64 15.95,64 17,62.95 17,56.35 17.95,55.45 28.7,55.45 29.5,54.65 29.5,-2.05 0.6,-2.1 0.25,80.5
+24V
  Top 0.5: J4.2 9.15,15.32 12.46,18.64 15.29,18.64 R16.2 20.15,18.7 R22.2
BATTIN  (via drill 0.35)
  Top 0.5: R22.1 R23.2 25.2,17.7 C4.1 v25.2,22.1 | v31.2,21.65 30.55,22.3 30.55,29.9 31.25,30.6 A1.20
  Bottom 0.5: v31.2,21.65 25.65,21.65 v25.2,22.1
BLUE_3V3  (via drill 0.35)
  Top 0.3: v18.55,38.65 U5.4
  Bottom 0.3: v18.55,38.65 18.95,38.65 19.53,39.23 19.53,43.47 20.88,44.83 29.61,44.83 31.02,43.41 31.02,41.23 31.49,40.76 A1.16
BLUE_OUT
  Top 0.5: U5.5 9.96,38.66 8.75,37.45 8.75,28.25 5,24.5 J1.1
D_N  (via drill 0.35)
  Top 0.125: v70.83,57.63 70.83,57.4 78.97,57.4 v79.25,57.66 | v78.74,12.6 78.97,12.6 78.97,11.88 78.7,11.6 X1.2
  Bottom 0.125: v70.83,57.63 70.83,57.4 57.08,57.4 A1.32 | v79.25,57.66 78.97,57.4 78.97,12.6 v78.74,12.6
D_P  (via drill 0.35)
  Top 0.125: v70.83,56.91 70.83,57.15 79.22,57.15 v79.5,56.88 | v79.46,12.6 79.22,12.6 79.22,11.88 79.5,11.6 X1.3
  Bottom 0.125: v70.83,56.91 70.83,57.15 57.08,57.15 A1.31 | v79.5,56.88 79.22,57.15 79.22,12.6 v79.46,12.6
ESTOP  (via drill 0.35)
  Top 0.3: v30,16.8 30,34.8 30.88,35.68 A1.18 | v30.25,2.5 9.81,2.5 J5.2
  Bottom 0.3: v30.25,2.5 31.3,3.55 31.3,15.5 v30,16.8
ETH_LED1
  Top 0.3: A1.30 59.92,57.45 R17.1
ETH_LED2
  Top 0.3: A1.29 59.31,54.3 R20.1
FRONT_HDR  (via drill 0.35)
  Top 0.5: Q5.5 Q5.6 Q5.7 Q5.8 17.48,6.75 v18.8,6.75
  Bottom 0.5: X6.1 25.37,5.82 23.8,4.25 21.3,4.25 v18.8,6.75
FRONT_LIGHT  (via drill 0.35)
  Top 0.5: v12.7,35.5 12.09,36.12 U5.7 | R26.1 14.55,17.15 v13.65,17.15
  Bottom 0.5: v13.65,17.15 12.7,18.1 v12.7,35.5
FRONT_LIGHT_3V3  (via drill 0.35)
  Top 0.3: v19.15,36.1 19.14,36.12 U5.2
  Bottom 0.3: v19.15,36.1 19.2,36.1 19.95,36.85 19.95,43.3 21.05,44.4 29.43,44.4 30.6,43.23 30.6,38.85 31.25,38.2 33.05,38.2 A1.17
FRONT_R
  Top 0.5: Q5.4 13.64,13.95 R26.2
GND  (via drill 0.35)
  Top 0.2: U1.20 22.8,65.8 23,65.6 U1.18 24.15,66 v24.6,66 | C2.2 26,63.7 v26.75,62.95 | C3.2 22.4,60.8 v23.15,60.8 | U1.9 22.02,63.12 22.02,63.47 22.18,63.62 22.62,63.62 22.75,63.49 22.75,63.15 U1.11 22.8,62.4 v23.2,62
  Top 0.3: C9.2 24.3,46.4 v23.8,46.9 | v75.25,44.25 74.58,43.58 X2.1 | X1.5 82,10.65 v82,11.75 | X5.1 72,26.38 v72,27.75 | R1.1 20.35,57.15 v19.8,56.6 | D4.C 37.69,27.5 v38.1,27.5 | D3.C 14.2,62.5 v15.15,63.45 | U2.9 49.58,24.12 v49.8,24.35
  Top 0.4: OK2.4 38.6,14.42 v38.6,14.05 | OK2.2 38.73,17.68 v39.1,18.05 | OK1.2 57.97,17.43 v58.1,17.3 | OK1.4 58.01,14.89 v58.1,14.8
  Top 0.5: C1.2 28.85,77.85 v29.5,78.5 | C7.2 v24.9,31.1 | D5.C 64.65,75.95 v65.25,76.55 | R23.1 27.65,17.65 v28.3,17 | C4.2 28.25,20.5 v28.4,20.35 | U4.2 44.47,67.67 v44.74,67.4 | U5.3 15.16,37.38 v14.7,37.85 | U6.3 15.31,43.73 v14.9,44.15 | U7.3 15.16,50.19 v14.8,50.55 | C8.2 48.56,70.94 v47.45,72.05 | D2.C 15.35,25 v15.7,25.35
  Bottom 0.5: v44.74,67.4 44.9,67.4
  pour Bottom: 0.5,83.5 98,83.5 98,-3.5 0.5,-3.5
GREEN_3V3  (via drill 0.35)
  Top 0.3: U6.2 17.91,42.47 v18.1,42.65
  Bottom 0.3: v18.1,42.65 20.7,45.25 29.78,45.25 31.73,43.3 A1.15
GREEN_OUT
  Top 0.5: J1.2 5.04,27.04 8.12,30.12 8.12,41.42 9.2,42.5 11.04,42.5 U6.7
GYRO_INT  (via drill 0.35)
  Top 0.2: U1.12 23.2,62.85 23.55,62.5 25.35,62.5 v25.4,62.45
  Bottom 0.2: A1.11 29.79,53.46 29.05,54.2 29.05,61.65 28.6,62.1 25.75,62.1 v25.4,62.45
INDI_LED_R
  Top 0.3: R1.2 D1.C
INDICATOR_LED
  Top 0.3: 25.58,58.1 D1.A 28.46,61.08 A1.8
L+12V
  Top 0.3: X3.2 X3.1 56.92,4.08 58,3 60.77,3 X3.5 X3.7 65.77,3 68.5,3 69.6,4.1 69.6,12.65 68.35,13.9 66.45,13.9 R12.2 66.35,14.95 R6.2
LALI
  Top 0.3: X3.6 62,7 60,9 60,17.2 61.51,18.7 | OK1.8 | OK1.8 R6.1
  Top 0.4: 61.51,18.7 OK1.8
LALI_CTRL
  Top 0.3: R4.1 51.25,22.2 52.85,22.2 54.1,23.45 54.1,28.77 A1.21
LBLI  (via drill 0.35)
  Top 0.3: OK1.6 62.48,16.16 R12.1 v64.65,12.85
  Bottom 0.3: 64.5,6.81 X3.8 64.65,6.88 v64.65,12.85
LBLI_CTRL
  Top 0.3: R9.1 50.1,18.7 50.1,22.05 50.67,22.62 52.67,22.62 53.67,23.63 53.67,30.89 A1.22
LDISABLE
  Top 0.3: R14.2 53.45,14.15 53.45,14.05 59.1,14.05 59.56,13.59 59.56,6.87 X3.4
LEA  (via drill 0.35)
  Top 0.3: X5.3 68.45,21 v67.9,20.45 | v51.17,26.07 U2.12
  Bottom 0.3: v67.9,20.45 64.38,16.93 60.28,16.93 57.83,19.38 52.83,19.38 52.33,19.88 52.33,23.27 52.75,23.7 52.75,24.5 v51.17,26.07
LEA3
  Top 0.3: A1.26 53.4,40.77 53.4,36.89 51.98,35.47 51.98,32.28 51.17,31.48 46.42,31.48 44.88,29.93 44.88,26.98 43.97,26.07 U2.5
LEB  (via drill 0.35)
  Top 0.3: X5.5 68.38,15.92 v67.8,16.5 | v50.38,25.43 U2.11
  Bottom 0.3: v67.8,16.5 60.1,16.5 57.65,18.95 52.65,18.95 51.9,19.7 51.9,23.9 v50.38,25.43
LEB3
  Top 0.3: U2.6 43.92,25.43 45.3,26.8 45.3,29.75 46.6,31.05 51.35,31.05 52.4,32.1 52.4,35.29 53.83,36.72 53.83,38.66 A1.25
LGND  (via drill 0.35)
  Top 0.3: OK1.7 61.18,16.8 60.93,16.8 60.74,16.61 60.74,15.72 60.93,15.54 61.18,15.54 OK1.5 | X3.9 X3.10 67.08,7.97 66.05,9 v63.25,9 61.82,10.43 OK1.5 | 61.92,14.8 OK1.5 | OK1.5 62.26,14.89 | v58,8.25 58,8.75 59.1,9.85 59.1,13.05 58.6,13.55 52.25,13.55 51.35,14.45 R14.1
  Bottom 0.3: v63.25,9 63.25,8.75 62.75,8.25 v58,8.25
MOTOR_CTRL  (via drill 0.35)
  Top 0.3: U2.16 47.34,29.2 v46.5,29.2 | v42.8,29.55 41.96,29.55 41.48,30.03 41.48,46.86 42.05,47.44 42.05,48 40.38,49.67 40.38,56.48 39.05,57.8 37.85,57.8 36.95,58.7 v36.95,59.05
  Bottom 0.3: v46.5,29.2 46.15,29.55 v42.8,29.55 | v36.95,59.05 36.95,71.65 36.1,72.5 26.25,72.5 24.65,74.1 20.02,74.1 J6.2
MOTOR_CTRL_3V3  (via drill 0.35)
  Top 0.3: v41.05,47.7 41.05,29.86 U2.1
  Bottom 0.3: A1.13 33.09,48.4 40.3,48.4 41,47.7 v41.05,47.7
N$1
  Top 0.3: R17.2 67.55,57.45 68.6,58.5 68.6,62.59 X7.A1
N$2  (via drill 0.35)
  Top 0.3: R20.2 66.28,57.02 67.73,57.02 69.03,58.32 69.03,60.35 70.25,61.58 v70.25,62.5
  Bottom 0.3: v70.25,62.5 70.25,69.32 X7.A2
R+12V
  Top 0.3: X4.2 X4.1 35.42,3.58 36,3 39.5,3 40.5,4 X4.5 X4.7 44.27,3 47.5,3 48.45,3.95 48.45,14.35 47.7,15.1 | R7.2 47.7,18.9 47.7,15.1 | 47.7,15.1 R13.2
R_OK3A
  Top 0.3: OK1.1 53.45,18.7 53.1,19.05 53.1,20.4 R4.2
R_OK3B
  Top 0.3: OK1.3 53.48,16.16 53.1,16.55 53.1,17.4 R9.2
R_OK4A
  Top 0.3: OK2.1 35.7,18.95 35.1,19.55 35.1,20.4 R5.2
R_OK4B
  Top 0.3: OK2.3 35.73,16.41 35.1,17.05 35.1,17.4 R10.2
RALI
  Top 0.3: X4.6 41.5,7.77 41.5,17.95 42.51,18.95 OK2.8 43.37,19 R7.1
RALI_CTRL  (via drill 0.35)
  Top 0.3: v35.35,21.8 34.5,21.8 R5.1 | A1.23 53.25,33 53.25,23.8 52.52,23.08 50.52,23.08 49.67,22.23 49.6,22.15 49.4,22.15 v49.35,22.1
  Bottom 0.3: v49.35,22.1 35.65,22.1 v35.35,21.8
RBLI  (via drill 0.35)
  Top 0.3: OK2.6 v44.6,16.41 44.63,16.41 R13.1
  Bottom 0.3: v44.6,16.41 43.14,14.96 43.14,6.87 X4.8
RBLI_CTRL  (via drill 0.35)
  Top 0.3: v34.85,22.55 34.52,22.23 33.49,22.23 32.42,21.16 32.42,19.94 33.25,19.11 R10.1 | A1.24 52.83,35.12 52.83,23.98 52.35,23.5 50.35,23.5 49.75,22.9 v48.95,22.9
  Bottom 0.3: v34.85,22.55 48.6,22.55 v48.95,22.9
RD_N  (via drill 0.35)
  Top 0.125: v62.15,66.9 61.75,67.3 71.7,67.3 72.84,66.16 X7.6
  Bottom 0.125: A1.36 57.28,68.7 58.43,67.56 61.5,67.56 v62.15,66.91 v62.15,66.9
RD_P  (via drill 0.35)
  Top 0.125: v61.4,66.9 61,67.3 61.25,67.55 71.7,67.55 72.85,68.7 X7.4
  Bottom 0.125: A1.35 57.3,66.16 58.45,67.31 61,67.31 v61.4,66.91 v61.4,66.9
RDISABLE
  Top 0.3: R15.2 37.1,14.55 38.06,13.59 38.06,6.87 X4.4
REA  (via drill 0.35)
  Top 0.3: U2.14 51.12,27.38 v51.45,27.7 | v68.4,37.5 69.4,38.5 X2.3
  Bottom 0.3: v51.45,27.7 52.02,27.12 56.77,27.12 57.97,28.32 65.45,28.32 68.4,31.27 v68.4,37.5
REA3
  Top 0.3: A1.28 55.93,47.29 52.52,43.88 52.52,37.23 51.12,35.83 51.12,32.63 50.82,32.33 46.42,32.33 | U2.3 43.58,27.38 44.02,27.82 44.02,30.28 46.07,32.33 46.42,32.33 | 46.42,32.33
REB  (via drill 0.35)
  Top 0.3: U2.13 51.73,26.73 v52,26.45 | v66.5,27.9 66.64,27.9 X2.5
  Bottom 0.3: v52,26.45 52.25,26.7 56.95,26.7 58.15,27.9 v66.5,27.9
REB3
  Top 0.3: U2.4 44.02,26.73 44.45,27.15 44.45,30.1 46.25,31.9 51,31.9 51.55,32.45 51.55,35.65 52.95,37.05 52.95,42.86 A1.27
RED_3V3  (via drill 0.35)
  Top 0.3: v18.8,45.7 17.22,45.7 U6.4
  Bottom 0.3: v18.8,45.7 18.82,45.67 32.91,45.67 A1.14
RED_OUT
  Top 0.5: 3.88,29.58 J1.3 5.93,29.58 7.5,31.15 7.5,43.3 9.25,45.05 11.03,45.05 U6.5
REGOUT_C
  Top 0.2: 22.22,62.58 22.35,62.71 22.35,63.05 U1.10 | 22.22,62.58 | C3.1 21.2,62.1 21.74,62.1 22.22,62.58
RGND  (via drill 0.35)
  Top 0.3: OK2.7 42.63,17 42.45,17 42.29,16.83 42.29,16 42.45,15.84 42.63,15.84 OK2.5 43.35,15.12 43.35,8.25 | X4.9 X4.10 | X4.10 45.45,6.77 | R15.1 33.25,14.15 34.25,13.15 36.9,13.15 37.63,12.41 37.63,8.38 v37,7.75 | X4.10 44.1,8.25 43.35,8.25 | 43.35,8.25 v42.47,8.25
  Bottom 0.3: v37,7.75 37.49,7.75 37.53,7.79 42.01,7.79 v42.47,8.25
SAFETY_HRD
  Top 0.5: Q4.6 8.5,72.15 J2.2 | Q4.6 Q4.5 Q4.2 Q4.1 Q4.6
SAFETY_LIGHT  (via drill 0.35)
  Top 0.5: U7.5 11.95,52.33 v11.95,52.85 | v6.5,64.8 R25.1
  Bottom 0.5: v11.95,52.85 11.95,63.85 11,64.8 v6.5,64.8
SAFETY_LIGHT_3V3  (via drill 0.35)
  Top 0.3: v19.15,50.6 18.3,51.45 U7.4
  Bottom 0.3: v19.15,50.6 19.15,47.9 20.95,46.1 27,46.1 31.82,50.92 A1.12
SAFETY_R
  Top 0.3: R25.2 Q4.3
SCL  (via drill 0.35)
  Top 0.2: U1.23 21.65,66.15 21.65,66.49 22.31,67.15 27.45,67.15 | v29.4,66.45 28.7,67.15 27.45,67.15 | R8.1 28.05,66.55 27.45,67.15
  Bottom 0.2: v29.4,66.45 29.4,56.8 30.25,55.95 33.02,55.95 A1.10
SDA  (via drill 0.35)
  Top 0.2: 21.2,67.65 U1.24 | 21.2,67.65 22.05,68.5 v27.95,68.5 | R11.1 18.95,65.4 21.2,67.65
  Bottom 0.2: A1.9 30.41,58.54 29.95,59 29.95,67.95 29.4,68.5 v27.95,68.5
TD_N  (via drill 0.35)
  Top 0.125: v61.54,61.78 61.98,62.23 61.73,62.48 57.08,62.48 A1.34
  Bottom 0.125: X7.3 73.41,70.36 72.66,71.11 71.39,71.11 70.54,71.97 64.74,71.97 64.42,71.65 64.42,62.59 64.06,62.23 61.98,62.23 v61.54,61.78
TD_P  (via drill 0.35)
  Top 0.125: v60.72,61.78 61.16,62.23 57.08,62.23 A1.33
  Bottom 0.125: X7.1 73.41,72.12 72.66,71.36 71.49,71.36 70.64,72.22 64.64,72.22 64.17,71.75 64.17,62.7 63.95,62.48 61.41,62.48 v60.72,61.78

### Text on the board
tPlace: 3.3V Plane | 3.3V Power | 5V to 3.3V / Regulator | 12V Plane | 5V Plane | 12V to 5V / Converter | 5V Power | NUC
tNames: - | S1 | - | + | - | + | - | + | - | +